# Altium schematic sheet main UI.SchDoc
size A4; SheetNumber: 6; SheetTotal: 6
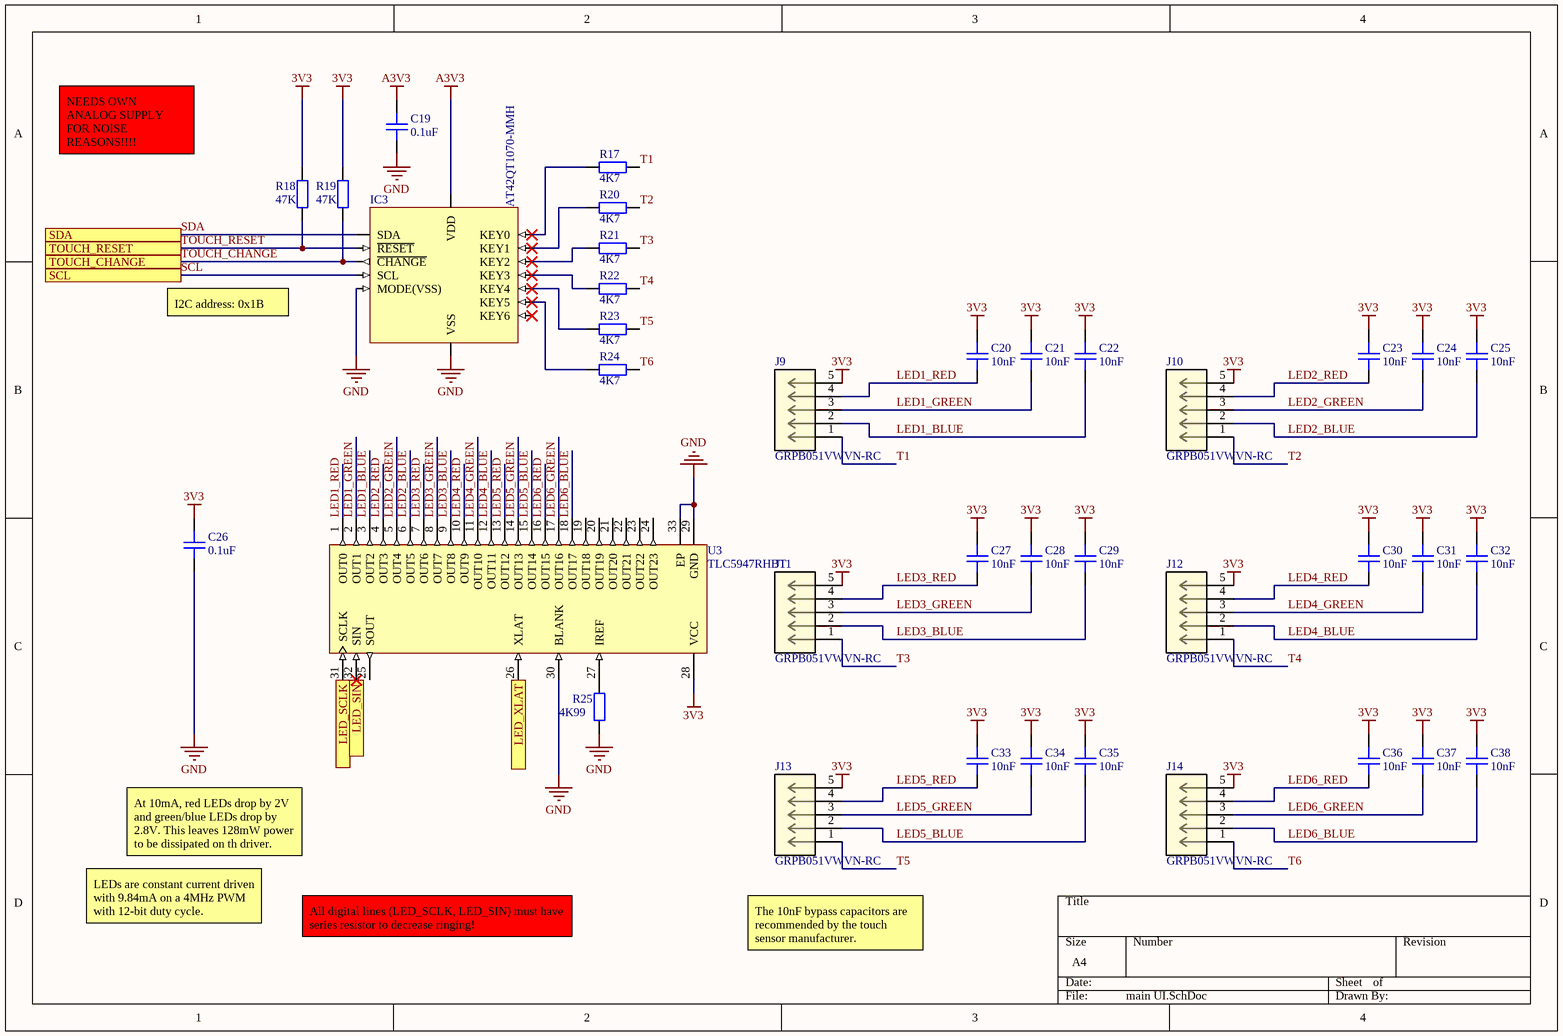
[diagram p0: main UI.SchDoc]

## Parts
C19  0.1uF  [1608[0603]_M]
C20  10nF  [1608[0603]_M]
C21  10nF  [1608[0603]_M]
C22  10nF  [1608[0603]_M]
C23  10nF  [1608[0603]_M]
C24  10nF  [1608[0603]_M]
C25  10nF  [1608[0603]_M]
C26  0.1uF  [1608[0603]_M]
C27  10nF  [1608[0603]_M]
C28  10nF  [1608[0603]_M]
C29  10nF  [1608[0603]_M]
C30  10nF  [1608[0603]_M]
C31  10nF  [1608[0603]_M]
C32  10nF  [1608[0603]_M]
C33  10nF  [1608[0603]_M]
C34  10nF  [1608[0603]_M]
C35  10nF  [1608[0603]_M]
C36  10nF  [1608[0603]_M]
C37  10nF  [1608[0603]_M]
C38  10nF  [1608[0603]_M]
IC3  AT42QT1070-MMH  [VQFN-20-EXPOSED-PAD_M]
J9  GRPB051VWVN-RC  [CONN5_1VWVN-RC_SUL]
J10  GRPB051VWVN-RC  [CONN5_1VWVN-RC_SUL]
J11  GRPB051VWVN-RC  [CONN5_1VWVN-RC_SUL]
J12  GRPB051VWVN-RC  [CONN5_1VWVN-RC_SUL]
J13  GRPB051VWVN-RC  [CONN5_1VWVN-RC_SUL]
J14  GRPB051VWVN-RC  [CONN5_1VWVN-RC_SUL]
R17  4K7  [1608[0603]_M]
R18  47K  [1608[0603]_M]
R19  47K  [1608[0603]_M]
R20  4K7  [1608[0603]_M]
R21  4K7  [1608[0603]_M]
R22  4K7  [1608[0603]_M]
R23  4K7  [1608[0603]_M]
R24  4K7  [1608[0603]_M]
R25  4K99  [1608[0603]_M]
U3  TLC5947RHBT  [RHB0032E_V]

## Ports
LED_SCLK (in), LED_SIN (in), LED_XLAT (in), SCL, SDA, TOUCH_CHANGE, TOUCH_RESET

## Nets
3V3: C20.2 C21.2 C22.2 C23.2 C24.2 C25.2 C26.2 C27.2 C28.2 C29.2 C30.2 C31.2 C32.2 C33.2 C34.2 C35.2 C36.2 C37.2 C38.2 J9.5 J10.5 J11.5 J12.5 J13.5 J14.5 R18.2 R19.2 U3.28(VCC)
A3V3: C19.2 IC3.9(VDD)
GND: C19.1 C26.1 IC3.8(VSS) IC3.11(MODE(VSS)) R25.1 U3.29(GND) U3.30(BLANK) U3.33(EP)
LED1_BLUE: C22.1 J9.2 U3.3(OUT2)
LED1_GREEN: C21.1 J9.3 U3.2(OUT1)
LED1_RED: C20.1 J9.4 U3.1(OUT0)
LED2_BLUE: C25.1 J10.2 U3.6(OUT5)
LED2_GREEN: C24.1 J10.3 U3.5(OUT4)
LED2_RED: C23.1 J10.4 U3.4(OUT3)
LED3_BLUE: C29.1 J11.2 U3.9(OUT8)
LED3_GREEN: C28.1 J11.3 U3.8(OUT7)
LED3_RED: C27.1 J11.4 U3.7(OUT6)
LED4_BLUE: C32.1 J12.2 U3.12(OUT11)
LED4_GREEN: C31.1 J12.3 U3.11(OUT10)
LED4_RED: C30.1 J12.4 U3.10(OUT9)
LED5_BLUE: C35.1 J13.2 U3.15(OUT14)
LED5_GREEN: C34.1 J13.3 U3.14(OUT13)
LED5_RED: C33.1 J13.4 U3.13(OUT12)
LED6_BLUE: C38.1 J14.2 U3.18(OUT17)
LED6_GREEN: C37.1 J14.3 U3.17(OUT16)
LED6_RED: C36.1 J14.4 U3.16(OUT15)
LED_SCLK: U3.31(SCLK) ; port LED_SCLK
LED_SIN: U3.32(SIN) ; port LED_SIN
LED_XLAT: U3.26(XLAT) ; port LED_XLAT
SCL: IC3.15(SCL) ; port SCL
SDA: IC3.12(SDA) ; port SDA
T1: J9.1 R17.1
T2: J10.1 R20.1
T3: J11.1 R21.1
T4: J12.1 R22.1
T5: J13.1 R23.1
T6: J14.1 R24.1
TOUCH_~{CHANGE}: IC3.14(~{CHANGE}) R19.1 ; port TOUCH_CHANGE
TOUCH_~{RESET}: IC3.13(~{RESET}) R18.1 ; port TOUCH_RESET
NetIC3_1: IC3.1(KEY4) R23.2
NetIC3_2: IC3.2(KEY3) R22.2
NetIC3_3: IC3.3(KEY2) R21.2
NetIC3_4: IC3.4(KEY1) R20.2
NetIC3_5: IC3.5(KEY0) R17.2
NetIC3_17: IC3.17(KEY5) R24.2
NetR25_2: R25.2 U3.27(IREF)

Not connected (* = marked no-connect by the designer): IC3 16(KEY6)*; U3 19(OUT18) 20(OUT19) 21(OUT20) 22(OUT21) 23(OUT22) 24(OUT23) 25(SOUT)

## Notes on the sheet
- NEEDS OWN ANALOG SUPPLY FOR NOISE REASONS!!!!
- I2C address: 0x1B
- At 10mA, red LEDs drop by 2V and green/blue LEDs drop by 2.8V. This leaves 128mW power to be dissipated on th driver.
- LEDs are constant current driven with 9.84mA on a 4MHz PWM with 12-bit duty cycle.
- All digital lines (LED_SCLK, LED_SIN) must have series resistor to decrease ringing!
- The 10nF bypass capacitors are recommended by the touch sensor manufacturer.

## Library data of the parts
C19-C38 = Capacitor: Generic Capacitor
  C19 C26: Value: 0.1uF
  C20-C25 C27-C38: Value: 10nF
IC3 = AT42QT1070: Seven-channel capacitive touch sensor (Comms mode)
J9-J14 = GRPB051VWVN-RC: No Description Available; Mfr_Name: Sullins; Copyright: Copyright (C) 2021 Ultra Librarian. All rights reserved.; Manufacturer_Part_Number: GRPB051VWVN-RC; Digi-Key_Part_Number_1: S9014E-05-ND; RefDes: RefDes; Type: DEV
R17-R25 = Resistor: Generic Resistor
  R17 R20-R24: Value: 4K7
  R18 R19: Value: 47K
  R25: Value: 4K99
U3 = CMP-0388-00648-2: 24-Channel, 12-Bit PWM LED Driver with Internal Oscillator, 3 to 5.5 V, -40 to 85 degC, 32-pin QFN (RHB32), Green (RoHS & no Sb/Br); Manufacturer: Texas Instruments; Vin(Max)(V): 5.5; Rating: Catalog; Vin(Min)(V): 3; Eco-Plan: Green (RoHS & no Sb/Br); PackageDescription: 32-Pin Plastic Flat Pack, Body 5 x 5 mm, Pitch 0.5 mm; Code_JEDEC: MO-220; DatasheetVersion: SBVS114A; ComponentLink1URL: http://www.ti.com/; Mounting Technology: Surface Mount; ComponentLink2Description: Datasheet; PackageReference: RHB0032E; ComponentLink3URL: http://www.ti.com/lit/ml/mpqf130c/mpqf130c.pdf; PartNumber: TLC5947RHBT; SubFamily: LED Driver; ComponentLink2URL: http://www.ti.com/general/docs/lit/getliterature.tsp?genericPartNumber=TLC5947&fileType=pdf; ComponentLink1Description: Manufacturer URL; PackageVersion: 4204326/D; ComponentLink3Description: Package Specification